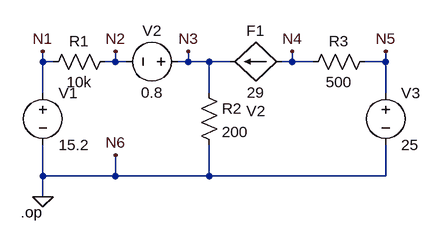
[diagram p0: schematic P_2-28.asc]
P_2-28.asc, the LTspice schematic file:
Version 4
SHEET 1 880 680
WIRE -48 64 -48 48
WIRE -32 64 -48 64
WIRE 64 64 64 48
WIRE 64 64 48 64
WIRE 80 64 64 64
WIRE 176 64 176 48
WIRE 176 64 160 64
WIRE 208 64 176 64
WIRE 240 64 208 64
WIRE 336 64 336 48
WIRE 336 64 320 64
WIRE 368 64 336 64
WIRE 480 64 480 48
WIRE 480 64 448 64
WIRE -48 112 -48 64
WIRE 208 112 208 64
WIRE 480 112 480 64
WIRE -48 240 -48 192
WIRE 64 240 64 208
WIRE 64 240 -48 240
WIRE 208 240 208 192
WIRE 208 240 64 240
WIRE 480 240 480 192
WIRE 480 240 208 240
WIRE -48 272 -48 240
FLAG -48 48 N1
FLAG 64 48 N2
FLAG 176 48 N3
FLAG 336 48 N4
FLAG 480 48 N5
FLAG 64 208 N6
FLAG -48 272 0
SYMBOL voltage -48 96 R0
WINDOW 123 0 0 Left 2
WINDOW 39 0 0 Left 2
SYMATTR InstName V1
SYMATTR Value 15.2
SYMBOL voltage 176 64 R90
WINDOW 0 -32 56 VBottom 2
WINDOW 3 32 56 VTop 2
WINDOW 123 0 0 Left 2
WINDOW 39 0 0 Left 2
SYMATTR InstName V2
SYMATTR Value 0.8
SYMBOL res -48 80 R270
WINDOW 0 32 56 VTop 2
WINDOW 3 0 56 VBottom 2
SYMATTR InstName R1
SYMATTR Value 10k
SYMBOL res 192 96 R0
SYMATTR InstName R2
SYMATTR Value 200
SYMBOL res 352 80 R270
WINDOW 0 32 56 VTop 2
WINDOW 3 0 56 VBottom 2
SYMATTR InstName R3
SYMATTR Value 500
SYMBOL voltage 480 96 R0
WINDOW 123 0 0 Left 2
WINDOW 39 0 0 Left 2
SYMATTR InstName V3
SYMATTR Value 25
SYMBOL f 320 64 R90
WINDOW 0 -32 40 VBottom 2
WINDOW 3 32 40 VTop 2
WINDOW 123 60 40 VTop 2
SYMATTR InstName F1
SYMATTR Value 29
SYMATTR Value2 V2
TEXT -82 296 Left 2 !.op

The netlist it stands for:
* P_2-28.asc
V1 N1 0 15.2
V2 N3 N2 0.8
R1 N1 N2 10k
R2 N3 0 200
R3 N4 N5 500
V3 N5 0 25
F1 N4 N3 29 V2
.op
.backanno
.end

* Results of the author's LTspice run, read from the files saved beside the schematic
* Operating Point:
*   V(n1) = 15.2 V
*   V(n3) = -20.36 V
*   V(n2) = -21.16 V
*   V(n4) = 77.73 V
*   V(n5) = 25 V
*   I(F1) = -105.5 mA
*   I(R3) = 105.5 mA
*   I(R2) = -101.8 mA
*   I(R1) = 3.636 mA
*   I(V3) = 105.5 mA
*   I(V2) = -3.636 mA
*   I(V1) = -3.636 mA